# EAGLE schematic relayboard (EAGLE 6.4)
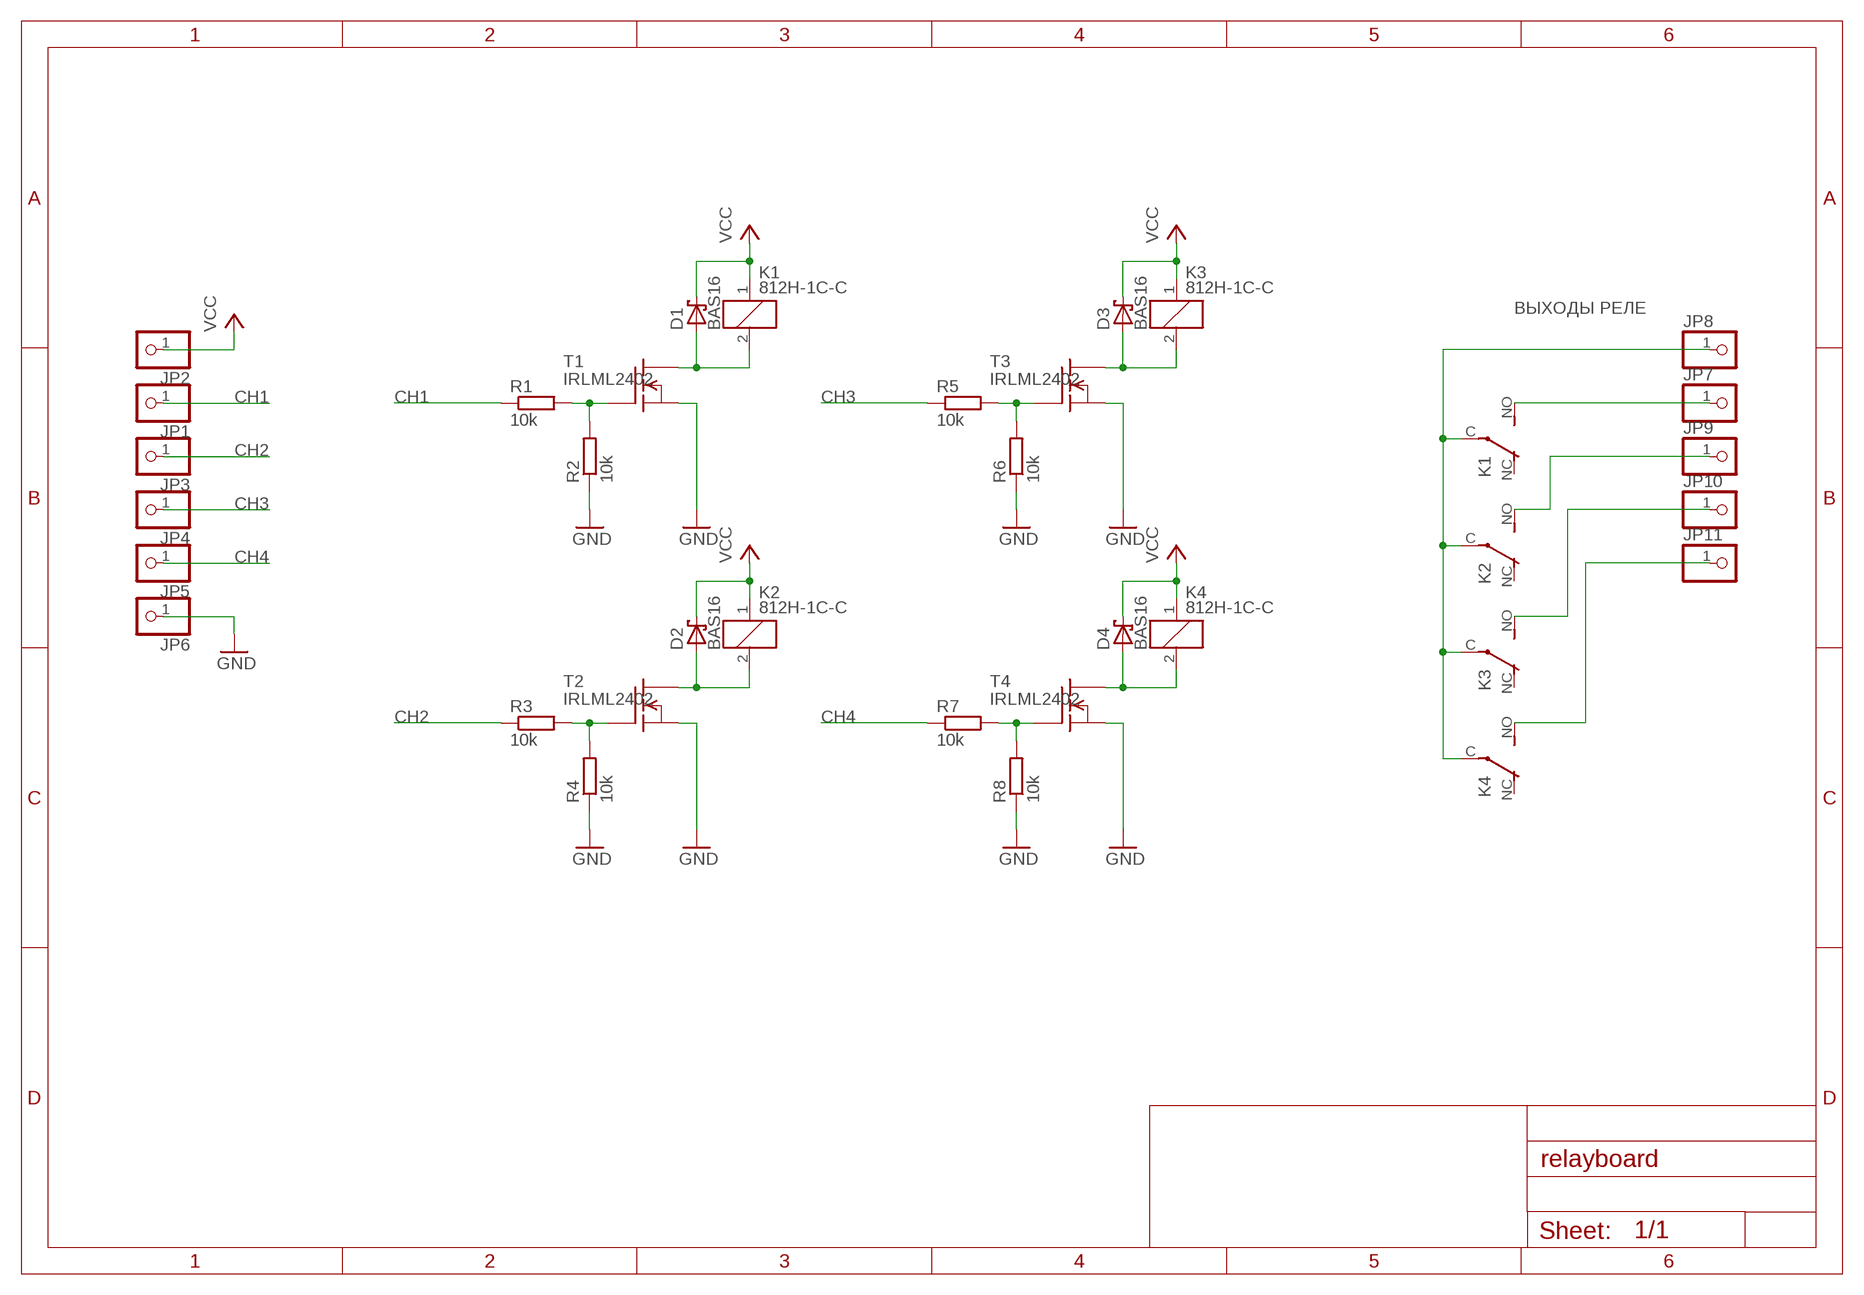
[diagram p0: schematic, sheet 1]

## Parts
D1  BAS16  [SOT23]
D2  BAS16  [SOT23]
D3  BAS16  [SOT23]
D4  BAS16  [SOT23]
JP1  PINHD-1X1  [1X01]
JP2  PINHD-1X1  [1X01]
JP3  PINHD-1X1  [1X01]
JP4  PINHD-1X1  [1X01]
JP5  PINHD-1X1  [1X01]
JP6  PINHD-1X1  [1X01]
JP7  PINHD-1X1  [1X01]
JP8  PINHD-1X1  [1X01]
JP9  PINHD-1X1  [1X01]
JP10  PINHD-1X1  [1X01]
JP11  PINHD-1X1  [1X01]
K1  812H-1C-C  [CQ1]
K2  812H-1C-C  [CQ1]
K3  812H-1C-C  [CQ1]
K4  812H-1C-C  [CQ1]
R1  10k  R-EU_M0805  [M0805]
R2  10k  R-EU_R0805  [R0805]
R3  10k  R-EU_R0805  [R0805]
R4  10k  R-EU_R0805  [R0805]
R5  10k  R-EU_R0805  [R0805]
R6  10k  R-EU_R0805  [R0805]
R7  10k  R-EU_R0805  [R0805]
R8  10k  R-EU_R0805  [R0805]
T1  IRLML2402  [SOT23]
T2  IRLML2402  [SOT23]
T3  IRLML2402  [SOT23]
T4  IRLML2402  [SOT23]

## Nets
CH1: JP1.1 R1.1
CH2: JP3.1 R3.1
CH3: JP4.1 R5.1
CH4: JP5.1 R7.1
GND: JP6.1 R2.1 R4.1 R6.1 R8.1 T1.2(S) T2.2(S) T3.2(S) T4.2(S)
N$1: D1.1(A) K1.2 T1.3(D)
N$2: D2.1(A) K2.2 T2.3(D)
N$3: R1.2 R2.2 T1.1(G)
N$4: R3.2 R4.2 T2.1(G)
N$5: D3.1(A) K3.2 T3.3(D)
N$6: R5.2 R6.2 T3.1(G)
N$7: D4.1(A) K4.2 T4.3(D)
N$8: R7.2 R8.2 T4.1(G)
N$10 [power]: JP8.1 K1.C(P) K2.C(P) K3.C(P) K4.C(P)
N$11 [power]: JP7.1 K1.NO(S)
N$12 [power]: JP9.1 K2.NO(S)
N$13 [power]: JP10.1 K3.NO(S)
N$14 [power]: JP11.1 K4.NO(S)
VCC: D1.3(C) D2.3(C) D3.3(C) D4.3(C) JP2.1 K1.1 K2.1 K3.1 K4.1
Unconnected: K1.NC(O) K2.NC(O) K3.NC(O) K4.NC(O)

## Notes on the sheet
- ВЫХОДЫ РЕЛЕ

## Library data of the parts
D1-D4 = ElLin:BAS16: Silicon Schottky Diodes General-purpose diode for high-speed switching
JP1-JP11 = pinhead:PINHD-1X1: PIN HEADER
K1-K4 = ElLin:812H-1C-C: 10A@250VAC Power Relay
R1-R8 = rcl:R-EU_: RESISTOR, European symbol
T1-T4 = ElLin:IRLML2402: HEXFET Power MOSFET

## Net classes
1 power: width 0.8 mm, drill 0.6 mm, clearance 1 mm